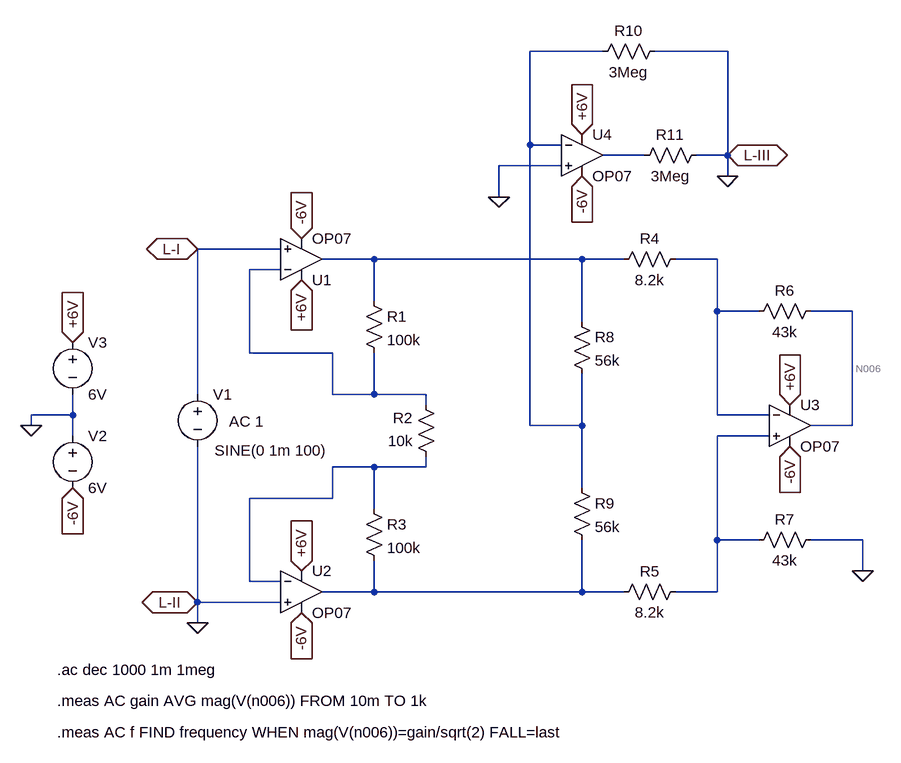
[diagram p0: schematic Instrumentation_Amplifier.asc]
Instrumentation_Amplifier.asc, the LTspice schematic file:
Version 4
SHEET 1 2224 680
WIRE 1136 -736 1024 -736
WIRE 1328 -736 1216 -736
WIRE 1024 -592 1024 -736
WIRE 1072 -592 1024 -592
WIRE 1200 -576 1136 -576
WIRE 1328 -576 1328 -736
WIRE 1328 -576 1280 -576
WIRE 1072 -560 976 -560
WIRE 1328 -544 1328 -576
WIRE 976 -512 976 -560
WIRE 640 -432 512 -432
WIRE 784 -416 704 -416
WIRE 1104 -416 784 -416
WIRE 1168 -416 1104 -416
WIRE 1312 -416 1248 -416
WIRE 640 -400 592 -400
WIRE 784 -352 784 -416
WIRE 1312 -336 1312 -416
WIRE 1376 -336 1312 -336
WIRE 1520 -336 1456 -336
WIRE 1104 -320 1104 -416
WIRE 592 -272 592 -400
WIRE 720 -272 592 -272
WIRE 512 -208 512 -432
WIRE 720 -208 720 -272
WIRE 784 -208 784 -272
WIRE 784 -208 720 -208
WIRE 864 -208 784 -208
WIRE 864 -192 864 -208
WIRE 320 -176 320 -208
WIRE 320 -176 256 -176
WIRE 1312 -176 1312 -336
WIRE 1392 -176 1312 -176
WIRE 256 -160 256 -176
WIRE 1024 -160 1024 -592
WIRE 1104 -160 1104 -240
WIRE 1104 -160 1024 -160
WIRE 1520 -160 1520 -336
WIRE 1520 -160 1456 -160
WIRE 320 -144 320 -176
WIRE 1392 -144 1312 -144
WIRE 784 -96 720 -96
WIRE 864 -96 864 -112
WIRE 864 -96 784 -96
WIRE 1104 -64 1104 -160
WIRE 720 -48 720 -96
WIRE 720 -48 592 -48
WIRE 784 -32 784 -96
WIRE 1312 16 1312 -144
WIRE 1376 16 1312 16
WIRE 1536 16 1456 16
WIRE 1536 64 1536 16
WIRE 592 80 592 -48
WIRE 640 80 592 80
WIRE 784 96 784 48
WIRE 784 96 704 96
WIRE 1104 96 1104 16
WIRE 1104 96 784 96
WIRE 1168 96 1104 96
WIRE 1312 96 1312 16
WIRE 1312 96 1248 96
WIRE 512 112 512 -128
WIRE 640 112 512 112
WIRE 512 144 512 112
FLAG 256 -160 0
FLAG 320 -288 +6V
IOPIN 320 -288 In
FLAG 672 -384 +6V
IOPIN 672 -384 In
FLAG 672 64 +6V
IOPIN 672 64 In
FLAG 1424 -192 +6V
IOPIN 1424 -192 In
FLAG 320 -64 -6V
IOPIN 320 -64 In
FLAG 672 -448 -6V
IOPIN 672 -448 In
FLAG 672 128 -6V
IOPIN 672 128 In
FLAG 1424 -128 -6V
IOPIN 1424 -128 In
FLAG 1536 64 0
FLAG 1104 -608 +6V
IOPIN 1104 -608 In
FLAG 1104 -544 -6V
IOPIN 1104 -544 In
FLAG 976 -512 0
FLAG 512 -432 L-I
IOPIN 512 -432 BiDir
FLAG 512 112 L-II
IOPIN 512 112 BiDir
FLAG 1328 -576 L-III
IOPIN 1328 -576 BiDir
FLAG 1328 -544 0
FLAG 512 144 0
SYMBOL res 768 -368 R0
SYMATTR InstName R1
SYMATTR Value 100k
SYMATTR SpiceLine tol=5 pwr=0.25
SYMBOL res 768 -48 R0
SYMATTR InstName R3
SYMATTR Value 100k
SYMATTR SpiceLine tol=5 pwr=0.25
SYMBOL OpAmps\\OP07 672 -352 M180
SYMATTR InstName U1
SYMBOL OpAmps\\OP07 672 32 R0
SYMATTR InstName U2
SYMBOL res 1264 -432 R90
WINDOW 0 0 56 VBottom 2
WINDOW 3 32 56 VTop 2
SYMATTR InstName R4
SYMATTR Value 8.2k
SYMATTR SpiceLine tol=5 pwr=0.25
SYMBOL res 1264 80 R90
WINDOW 0 0 56 VBottom 2
WINDOW 3 32 56 VTop 2
SYMATTR InstName R5
SYMATTR Value 8.2k
SYMATTR SpiceLine tol=5 pwr=0.25
SYMBOL OpAmps\\OP07 1424 -224 R0
SYMATTR InstName U3
SYMBOL voltage 320 -160 R0
WINDOW 123 0 0 Left 0
WINDOW 39 0 0 Left 0
SYMATTR InstName V2
SYMATTR Value 6V
SYMBOL voltage 320 -304 R0
WINDOW 123 0 0 Left 0
WINDOW 39 0 0 Left 0
SYMATTR InstName V3
SYMATTR Value 6V
SYMBOL res 1472 -352 R90
WINDOW 0 0 56 VBottom 2
WINDOW 3 32 56 VTop 2
SYMATTR InstName R6
SYMATTR Value 43k
SYMATTR SpiceLine tol=5 pwr=0.25
SYMBOL res 1472 0 R90
WINDOW 0 0 56 VBottom 2
WINDOW 3 32 56 VTop 2
SYMATTR InstName R7
SYMATTR Value 43k
SYMATTR SpiceLine tol=5 pwr=0.25
SYMBOL res 880 -96 R180
WINDOW 0 36 76 Left 2
WINDOW 3 36 40 Left 2
SYMATTR InstName R2
SYMATTR Value 10k
SYMATTR SpiceLine tol=5 pwr=0.25
SYMBOL res 1088 -336 R0
SYMATTR InstName R8
SYMATTR Value 56k
SYMATTR SpiceLine tol=5 pwr=0.25
SYMBOL res 1088 -80 R0
SYMATTR InstName R9
SYMATTR Value 56k
SYMATTR SpiceLine tol=5 pwr=0.25
SYMBOL OpAmps\\OP07 1104 -640 R0
SYMATTR InstName U4
SYMBOL res 1232 -752 R90
WINDOW 0 0 56 VBottom 2
WINDOW 3 32 56 VTop 2
SYMATTR InstName R10
SYMATTR Value 3Meg
SYMATTR SpiceLine tol=5 pwr=0.25
SYMBOL res 1296 -592 R90
WINDOW 0 0 56 VBottom 2
WINDOW 3 32 56 VTop 2
SYMATTR InstName R11
SYMATTR Value 3Meg
SYMATTR SpiceLine tol=5 pwr=0.25
SYMBOL voltage 512 -224 R0
WINDOW 3 26 102 Left 2
WINDOW 123 49 58 Left 2
WINDOW 39 0 0 Left 0
SYMATTR InstName V1
SYMATTR Value SINE(0 1m 100)
SYMATTR Value2 AC 1
TEXT 296 216 Left 2 !.ac dec 1000 1m 1meg
TEXT 296 264 Left 2 !.meas AC gain AVG mag(V(n006)) FROM 10m TO 1k
TEXT 296 312 Left 2 !.meas AC f FIND frequency WHEN mag(V(n006))=gain/sqrt(2) FALL=last

The netlist it stands for:
* Instrumentation_Amplifier.asc
R1 N003 N005 100k tol=5 pwr=0.25
R3 N008 N009 100k tol=5 pwr=0.25
XU1 L-I N005 +6V -6V N003 LT1001  ; OP07, pins In+ In- V+ V- OUT
XU2 0 N008 +6V -6V N009 LT1001  ; OP07, pins In+ In- V+ V- OUT
R4 N004 N003 8.2k tol=5 pwr=0.25
R5 N007 N009 8.2k tol=5 pwr=0.25
XU3 N007 N004 +6V -6V N006 LT1001  ; OP07, pins In+ In- V+ V- OUT
V2 0 -6V 6V
V3 +6V 0 6V
R6 N006 N004 43k tol=5 pwr=0.25
R7 0 N007 43k tol=5 pwr=0.25
R2 N008 N005 10k tol=5 pwr=0.25
R8 N003 N001 56k tol=5 pwr=0.25
R9 N001 N009 56k tol=5 pwr=0.25
XU4 0 N001 +6V -6V N002 LT1001  ; OP07, pins In+ In- V+ V- OUT
R10 0 N001 3Meg tol=5 pwr=0.25
R11 0 N002 3Meg tol=5 pwr=0.25
V1 L-I 0 SINE(0 1m 100) AC 1
.ac dec 1000 1m 1meg
.meas AC gain AVG mag(V(n006)) FROM 10m TO 1k
.meas AC f FIND frequency WHEN mag(V(n006))=gain/sqrt(2) FALL=last
.lib LTC.lib
.backanno
.end